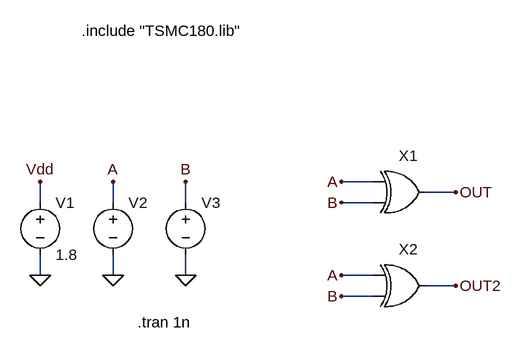
[diagram p0: schematic xor_test.asc]
xor_test.asc, the LTspice schematic file:
Version 4
SHEET 1 1392 680
WIRE 768 160 720 160
WIRE 896 176 848 176
WIRE 256 192 256 160
WIRE 368 192 368 160
WIRE 480 192 480 160
WIRE 768 192 720 192
WIRE 256 304 256 272
WIRE 368 304 368 272
WIRE 480 304 480 272
WIRE 768 304 720 304
WIRE 896 320 848 320
WIRE 768 336 720 336
FLAG 256 304 0
FLAG 256 160 Vdd
FLAG 720 160 A
FLAG 720 192 B
FLAG 896 176 OUT
FLAG 368 304 0
FLAG 368 160 A
FLAG 480 304 0
FLAG 480 160 B
FLAG 720 304 A
FLAG 720 336 B
FLAG 896 320 OUT2
SYMBOL voltage 256 176 R0
WINDOW 123 0 0 Left 0
WINDOW 39 0 0 Left 0
SYMATTR InstName V1
SYMATTR Value 1.8
SYMBOL xor 816 112 R0
SYMATTR InstName X1
SYMBOL voltage 368 176 R0
WINDOW 123 0 0 Left 0
WINDOW 39 0 0 Left 0
WINDOW 3 24 96 Invisible 2
SYMATTR InstName V2
SYMATTR Value PULSE(0 1.8 400p 10p 10p 400p 800p 1)
SYMBOL voltage 480 176 R0
WINDOW 123 0 0 Left 0
WINDOW 39 0 0 Left 0
WINDOW 3 24 96 Invisible 2
SYMATTR InstName V3
SYMATTR Value PULSE(0 1.8 200p 10p 10p 200p 400p 2)
SYMBOL xor2 816 256 R0
SYMATTR InstName X2
TEXT 320 -72 Left 2 !.include "TSMC180.lib"
TEXT 406 376 Left 2 !.tran 1n

The netlist it stands for:
* xor_test.asc
V1 Vdd 0 1.8
XX1 A B OUT xor VDD=1.8 L_INV=0.18u LD=0.48u WN_INV=0.42u WPFACT=1.5 L_TG=0.18u W_TG=0.42u  ; pins A B OUT
V2 A 0 PULSE(0 1.8 400p 10p 10p 400p 800p 1)
V3 B 0 PULSE(0 1.8 200p 10p 10p 200p 400p 2)
XX2 A B OUT2 xor2 VDD=1.8 L=0.18u LD=0.48u WN=0.42u WPFACT=1.5  ; pins A B OUT
.include "TSMC180.lib"
.tran 1n
.backanno
.end